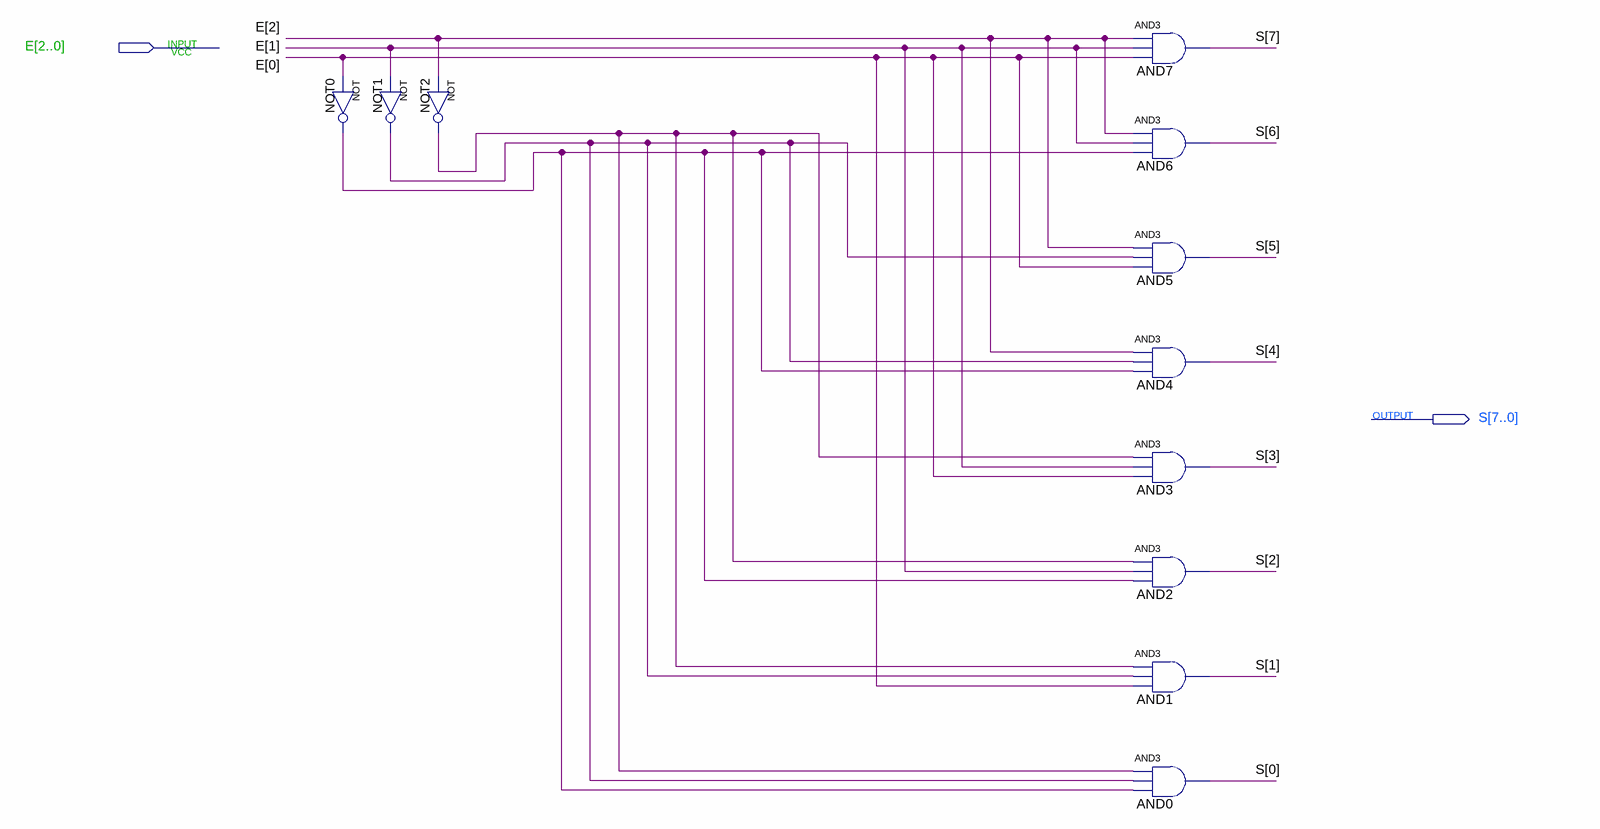
[diagram p0: schematic sheet]
// Quartus schematic DECOD_3_8.bdf as structural Verilog: 11 symbols, 2 pins
module DECOD_3_8 (
  input  [2:0] E,
  output [7:0] S
);

  wire NOT0_out, NOT1_out, NOT2_out;

  not NOT0 (NOT0_out, E[0]);
  not NOT1 (NOT1_out, E[1]);
  not NOT2 (NOT2_out, E[2]);
  and AND7 (S[7], E[2], E[1], E[0]);
  and AND6 (S[6], E[2], E[1], NOT0_out);
  and AND5 (S[5], E[2], NOT1_out, E[0]);
  and AND4 (S[4], E[2], NOT1_out, NOT0_out);
  and AND3 (S[3], NOT2_out, E[1], E[0]);
  and AND2 (S[2], NOT2_out, E[1], NOT0_out);
  and AND1 (S[1], NOT2_out, NOT1_out, E[0]);
  and AND0 (S[0], NOT2_out, NOT1_out, NOT0_out);
endmodule
